# EAGLE schematic handle (EAGLE 9.2.0)
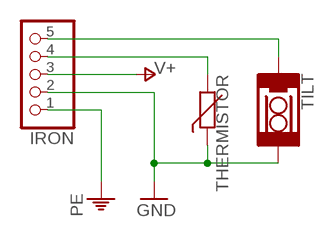
[diagram p0: schematic, sheet 1]

## Parts
IRON  PINHD-1X5  [1X05]
THERMISTOR  THERMISTOR_R-2,5  [RS-2,5]
TILT  SQ-SEN-200  [SQ-SEN-200]

## Nets
GND: IRON.2 THERMISTOR.1 TILT.2
N$1: IRON.4 THERMISTOR.2
N$2: IRON.5 TILT.1
PE: IRON.1
V+: IRON.3

## Library data of the parts
IRON = pinhead:PINHD-1X5: PIN HEADER
THERMISTOR = discrete:THERMISTOR_: Thermo Resistor
TILT = sensor-signalquest:SQ-SEN-200: TILT AND VIBRATION SENSOR OMNIDIRECTIONAL